# Altium schematic sheet Li-Ion Charger.SchDoc
size A4; SheetNumber: 1; SheetTotal: 3
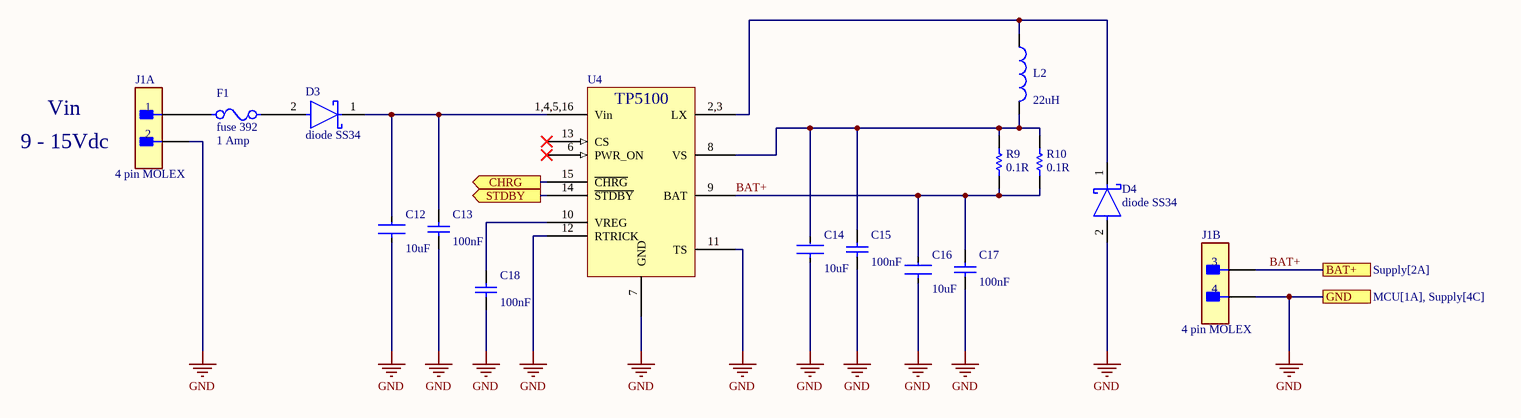
[diagram p0: Li-Ion Charger.SchDoc]

## Parts
C12  value 10uF  [FP-GRM31-0_2-IPC_B]  (hidden comment: capacitor smd 1206 10uF)
C13  value 100nF  [CAPC2013X140X50LL20T25]  (hidden comment: capacitor smd 0805 100nF)
C14  value 10uF  [FP-GRM31-0_2-IPC_B]  (hidden comment: capacitor smd 1206 10uF)
C15  value 100nF  [CAPC2013X140X50LL20T25]  (hidden comment: capacitor smd 0805 100nF)
C16  value 10uF  [FP-GRM31-0_2-IPC_B]  (hidden comment: capacitor smd 1206 10uF)
C17  value 100nF  [CAPC2013X140X50LL20T25]  (hidden comment: capacitor smd 0805 100nF)
C18  value 100nF  [CAPC2013X140X50LL20T25]  (hidden comment: capacitor smd 0805 100nF)
D3  diode SS34  [FP-SS34LWH-MFG]
D4  diode SS34  [FP-SS34LWH-MFG]
F1  fuse 392  value 1 Amp  [FP-396-MFG]
J1  4 pin MOLEX  [FP-39-29-3046-MFG]  (parts A,B of 2)
L2  value 22uH  [WE-PD 1050]  (hidden comment: power inductor 220uH)
R9  value 0.1R  [RESC3216X89X51NL25T25]  (hidden comment: resistor smd 1206 R100)
R10  value 0.1R  [RESC3216X89X51NL25T25]  (hidden comment: resistor smd 1206 R100)
U4  TP5100  [QFN65P400X400X90_HS-17M]  (value not drawn)

## Ports
BAT+ (see Supply[2A]), CHRG (out), GND (see MCU[1A], Supply[4C]), STDBY (out)

## Nets
GND: C12.1 C13.1 C14.1 C15.1 C16.1 C17.1 C18.1 D4.2(A) J1.2 J1.4 U4.7(GND) U4.11(TS) U4.12(RTRICK) ; port GND
BAT+: C16.2 C17.2 J1.3 R9.1 R10.1 U4.9(BAT) ; port BAT+
CHRG: U4.15(~{CHRG}) ; port CHRG
STDBY: U4.14(~{STDBY}) ; port STDBY
NetC12_2: C12.2 C13.2 D3.1(C) U4.1,4,5,16(Vin)
NetC14_2: C14.2 C15.2 L2.2 R9.2 R10.2 U4.8(VS)
NetC18_2: C18.2 U4.10(VREG)
NetD3_2: D3.2(A) F1.2
NetD4_1: D4.1(C) L2.1 U4.2,3(LX)
NetF1_1: F1.1 J1.1

Not connected (* = marked no-connect by the designer): U4 6(PWR_ON)* 13(CS)*

## Notes on the sheet
- Vin
- (near J1) 9 - 15Vdc

## Library data of the parts
C12 C14 C16 = CMP-001-00086-1: Multilayer Ceramic Capacitors MLCC - SMD/SMT 1206 10uF 50volt X5R +/-10%
C13 C15 C17 C18 = CMP-001-00085-1: Cap Ceramic 0.1uF 50V X7R 10% Pad SMD 0805 FlexiTerm 125C Automotive T/R
D3 D4 = CMP-004-00032-2: Rectifier Diode Schottky 40V 3A Automotive 2-Pin SOD-123W T/R
F1 = CMP-005-00013-1: Fuse Subminiature Slow Blow Acting 0.05A 125V Radial 8.5 X 4 X 8mm Bulk UL
J1 = CMP-002-00073-1: Connector Wire to Board Header 4 Position 4.2mm Solder Straight Thru-Hole
L2 = CMP-006-00021-1: Fixed Ind 22UH 1A 439 Mohm SMD
R9 R10 = CMP-009-00178-1: Res Metal Strip 1206 0.1 Ohm 1% 1/4W ±75ppm/°C Molded SMD SMD Embossed Plastic T/R
U4 = CMP-019-00049-3: 2A-switch buck 8.4V / 4.2V rechargeable lithium battery Charger